# Altium schematic sheet alimentation.SchDoc
size A4; SheetNumber: 1; SheetTotal: 2
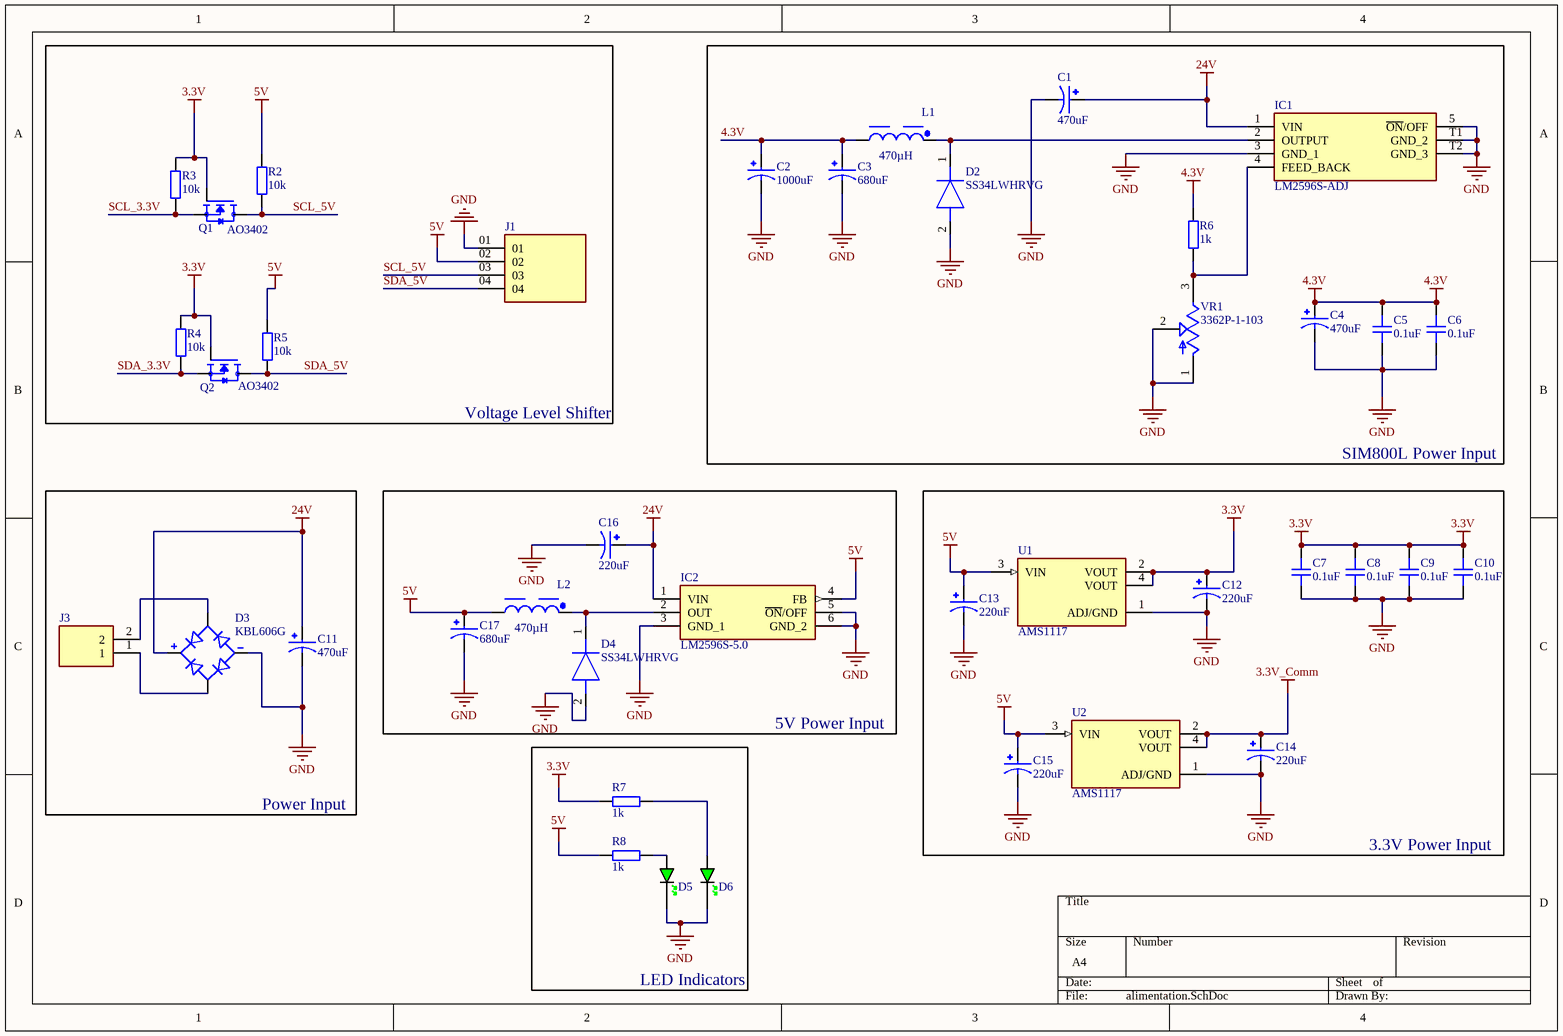
[diagram p0: alimentation.SchDoc]

## Parts
C1  470uF  [CAPPRD500W60D1000H1600]
C2  1000uF  [CAPPRD500W60D1000H2500]
C3  680uF  [CAPPRD500W60D1000H1600]
C4  470uF  [CAPPRD500W60D1000H1600]
C5  0.1uF  [CAP_0805]
C6  0.1uF  [CAP_0805]
C7  0.1uF  [CAP_0805]
C8  0.1uF  [CAP_0805]
C9  0.1uF  [CAP_0805]
C10  0.1uF  [CAP_0805]
C11  470uF  [CAPPRD500W60D1000H1600]
C12  220uF  [CAPPRD500W60D800H1150]
C13  220uF  [CAPPRD500W60D800H1150]
C14  220uF  [CAPPRD500W60D800H1150]
C15  220uF  [CAPPRD500W60D800H1150]
C16  220uF  [CAPPRD500W60D800H1150]
C17  680uF  [CAPPRD500W60D1000H1600]
D2  SS34LWHRVG  [SODFL3718X102N]
D3  KBL606G  [SIP600W130P510L1900H1630Q4]
D4  SS34LWHRVG  [SODFL3718X102N]
D5  GREEN  [LED_0805_GREEN]  (value not drawn)
D6  GREEN  [LED_0805_GREEN]  (value not drawn)
IC1  LM2596S-ADJ  [LM2596SXADJ]
IC2  LM2596S-5.0  [KTT0005B]
J1  MTSW-104-08-S-S-270  [SAMTEC_MTSW-104-08-S-S-270]  (value not drawn)
J3  TBP04R12-500-02BE  [CUI_TBP04R12-500-02BE]  (value not drawn)
L1  470µH  [WE-PD HV_1210]
L2  470µH  [WE-PD HV_1210]
Q1  AO3402  [SOT95P280X125-3N]
Q2  AO3402  [SOT95P280X125-3N]
R2  10k  [RES_1206]
R3  10k  [RES_1206]
R4  10k  [RES_1206]
R5  10k  [RES_1206]
R6  1k  [RES_1206]
R7  1k  [RES_1206]
R8  1k  [RES_1206]
U1  AMS1117  [SOT229P700X180-4N]
U2  AMS1117  [SOT229P700X180-4N]
VR1  3362P-1-103  [TRIM_3362P-1-103]

## Blocks framed on the sheet
Voltage Level Shifter: J1 Q1 Q2 R2-R5
SIM800L Power Input: C1-C6 D2 IC1 L1 R6 VR1
Power Input: C11 D3 J3
5V Power Input: C16 C17 D4 IC2 L2
3.3V Power Input: C7-C10 C12-C15 U1 U2
LED Indicators: D5 D6 R7 R8

## Nets
3.3V: C7.2 C8.2 C9.2 C10.2 C12.P Q1.1(G) Q2.1(G) R3.1 R4.1 R7.1 U1.2(VOUT) U1.4(VOUT)
3.3V_Comm: C14.P U2.2(VOUT) U2.4(VOUT)
4.3V: C2.P C3.P C4.P C5.2 C6.2 L1.2 R6.2
5V: C13.P C15.P C17.P IC2.4(FB) J1.02 L2.2 R2.1 R5.1 R8.1 U1.3(VIN) U2.3(VIN)
24V: C1.P C11.P C16.P D3.POS IC1.1(VIN) IC2.1(VIN)
GND: C1.N C2.N C3.N C4.N C5.1 C6.1 C7.1 C8.1 C9.1 C10.1 C11.N C12.N C13.N C14.N C15.N C16.N C17.N D2.2(A) D3.NEG D4.2(A) D5.K D6.K IC1.3(GND_1) IC1.5(~{ON}/OFF) IC1.T1(GND_2) IC1.T2(GND_3) IC2.3(GND_1) IC2.5(~{ON}/OFF) IC2.6(GND_2) J1.01 U1.1(ADJ/GND) U2.1(ADJ/GND) VR1.1(CCW) VR1.2(WIPER)
SCL_3.3V: Q1.2(S) R3.2
SCL_5V: J1.03 Q1.3(D) R2.2
SDA_3.3V: Q2.2(S) R4.2
SDA_5V: J1.04 Q2.3(D) R5.2
NetD2_1: D2.1(K) IC1.2(OUTPUT) L1.1
NetD3_AC1: D3.AC1 J3.2
NetD3_AC2: D3.AC2 J3.1
NetD4_1: D4.1(K) IC2.2(OUT) L2.1
NetD5_A: D5.A R8.2
NetD6_A: D6.A R7.2
NetIC1_4: IC1.4(FEED_BACK) R6.1 VR1.3(CW)

## Library data of the parts
C1 C3 C4 C11 C17 = EEUHD1V681B: CAP ALUM 680UF 20% 35V RADIAL; MF: Panasonic; MP: EEU-HD1V681B; Package: RADIAL-2 Panasonic; Price: None; Check_prices: https://www.snapeda.com/parts/EEU-HD1V681B/Panasonic/view-part/?ref=eda; Value: *; SnapEDA_Link: https://www.snapeda.com/parts/EEU-HD1V681B/Panasonic/view-part/?ref=snap; Availability: In Stock; Purchase-URL: https://pricing.snapeda.com/search?q=EEU-HD1V681B&ref=eda
C2 = EEUFS1V102L: 1000ÂµF 35V Aluminum Electrolytic Capacitors Radial, Can 10000 Hrs @ 105Â°C; MF: Panasonic; Package: RADIAL-2 Panasonic; SnapEDA_Link: https://www.snapeda.com/parts/EEUFS1V102L/Panasonic/view-part/?ref=snap; Value: *; MP: EEUFS1V102L; Check_prices: https://www.snapeda.com/parts/EEUFS1V102L/Panasonic/view-part/?ref=eda; Availability: In Stock; Purchase-URL: https://pricing.snapeda.com/search/part/EEUFS1V102L/?ref=eda; Price: None
C5-C10 = CAP_0805: Capacitor SMD 0805; Manufacturer: *; Manufacturer Part Number: *; Distributor Link: *; LCSC: *; Rating: *; Dielectric: *
C12-C16 = EEUHD1V221B: Cap Aluminum 220uF 35V 20% (8 X 11.5mm) Radial 5mm 270mA 1000 hr 105C Ammo Pack; MP: EEU-HD1V221B; MF: Panasonic; Package: RADIAL-2 Panasonic; Availability: In Stock; Value: *; SnapEDA_Link: https://www.snapeda.com/parts/EEU-HD1V221B/Panasonic/view-part/?ref=snap; Price: None; Check_prices: https://www.snapeda.com/parts/EEU-HD1V221B/Panasonic/view-part/?ref=eda; Purchase-URL: https://pricing.snapeda.com/search/part/EEU-HD1V221B/?ref=eda
D2 D4 = SS34LWHRVG: Diode; Manufacturer_Name: Taiwan Semiconductor; Datasheet Link: https://datasheet.datasheetarchive.com/originals/distributors/DKDS-20/389381.pdf; Height: 1.02mm; Manufacturer_Part_Number: SS34LWHRVG; Mouser Part Number: 821-SS34LWHRVG; Mouser Price/Stock: https://www.mouser.co.uk/ProductDetail/Taiwan-Semiconductor/SS34LWHRVG?qs=5aG0NVq1C4zYvYQjFNyRbA%3D%3D; Arrow Part Number: SS34LWHRVG; Arrow Price/Stock: https://www.arrow.com/en/products/ss34lwhrvg/taiwan-semiconductor?region=asia
D5 D6 = LED_0805_GREEN: LED 0805 GREEN SMD; Manufacturer: *; Manufacturer Part Number: *; Distributor Link: *; LCSC: *
IC1 = LM2596S-ADJ: Integrated Circuit; Manufacturer_Name: Texas Instruments; Datasheet Link: https://www.ti.com/lit/ds/symlink/lm2596.pdf?HQS=ti-null-null-sf-df-pf-sep-wwe&ts=1592978195629; Height: 4.57mm; Manufacturer_Part_Number: LM2596S-ADJ; Mouser Part Number: 926-LM2596S-ADJ; Mouser Price/Stock: https://www.mouser.co.uk/ProductDetail/Texas-Instruments/LM2596S-ADJ?qs=X1J7HmVL2ZGmRmhAtwKZ2Q%3D%3D
IC2 = LM2596S-5.0: Integrated Circuit; Manufacturer_Name: Texas Instruments; Datasheet Link: https://www.ti.com/lit/gpn/LM2596; Manufacturer_Part_Number: LM2596S-5.0; Mouser Part Number: 926-LM2596S-50; Mouser Price/Stock: https://www.mouser.co.uk/ProductDetail/Texas-Instruments/LM2596S-5.0?qs=X1J7HmVL2ZGcOr96VNr%252B%2Fw%3D%3D; Arrow Part Number: LM2596S-5.0; Arrow Price/Stock: https://www.arrow.com/en/products/lm2596s-5.0/texas-instruments?region=nac
J1 = MTSW-104-08-S-S-270: Connector Header Through Hole 4 position 0.100 (2.54mm); MF: Samtec; SnapEDA_Link: https://www.snapeda.com/parts/MTSW-104-08-S-S-270/Samtec/view-part/?ref=snap; Package: None; Value: *; MP: MTSW-104-08-S-S-270; Check_prices: https://www.snapeda.com/parts/MTSW-104-08-S-S-270/Samtec/view-part/?ref=eda
J3 = TBP04R12-500-02BE: 2~24 Poles, Pluggable, Receptacle, Horizontal, 5.0 Pitch, Terminal Block Connector; MF: Same Sky; SnapEDA_Link: https://www.snapeda.com/parts/TBP04R12-500-02BE/Same+Sky/view-part/?ref=snap; Package: None; Value: *; MP: TBP04R12-500-02BE; Check_prices: https://www.snapeda.com/parts/TBP04R12-500-02BE/Same+Sky/view-part/?ref=eda
L1 L2 = 7687709102: WE-PD HV High Voltage Power Inductor, SMT, size 1210, 1000µH, 0.72A, 1.4Ω; Manufacturer: Wurth Elektronik; Case/Size Code: 1210; DC Resistance: 1.2Ω; Operating Voltage (DC): 400V; Saturation Current: 0.9A; Self Resonant Frequency: 1.2MHz; Manufacturer Part Number: 7687709102; Category: Power Inductors; Match Code: WE-PD HV; ComponentLink1Description: Website Link; ComponentLink1URL: https://www.we-online.com/redexpert/article/7687709102?ad; ComponentLink2Description: Datasheet Link; ComponentLink2URL: https://www.we-online.com/redexpert/spec/7687709102?ad; Mount: Surface Mount; Min Operating Temperature: -40°C; Max Operating Temperature: 125°C; Packaging: Tape and Reel; Length: 12mm; Width: 12mm; Height: 10.5mm; DC Resistance Max: 1.4Ω; Inductance: 1000µH; Rated Current: 0.72A
Q1 Q2 = AO3402: N-Channel 30 V 4A (Ta) 1.4W (Ta) Surface Mount SOT-23-3; MF: Alpha & Omega Semiconductor; SnapEDA_Link: https://www.snapeda.com/parts/AO3402/Alpha/view-part/?ref=snap; Package: SOT-23 Alpha &amp; Omega Semiconductor; Value: *; MP: AO3402; Check_prices: https://www.snapeda.com/parts/AO3402/Alpha/view-part/?ref=eda
R2-R8 = RES_1206: Resistor SMD 1206; Manufacturer: *; Manufacturer Part Number: *; Distributor Link: *; LCSC: *
U1 U2 = AMS1117: 1A LOW DROPOUT VOLTAGE REGULATOR SOT-223; MF: Advanced Monolithic Systems; SnapEDA_Link: https://www.snapeda.com/parts/AMS1117/Advanced+Monolithic+Systems/view-part/?ref=snap; Package: SOT-223 Seeed Technology; Value: *; MP: AMS1117; Check_prices: https://www.snapeda.com/parts/AMS1117/Advanced+Monolithic+Systems/view-part/?ref=eda
VR1 = 3362P-1-103: TRIMMER - 1/4in SQ ST CERMET | Bourns 3362P-1-103; SnapEDA_Link: https://www.snapeda.com/parts/3362P-1-103/Bourns/view-part/?ref=snap; Package: 3362P-1 Bourns Inc.; Value: *; MF: Bourns; MP: 3362P-1-103; Check_prices: https://www.snapeda.com/parts/3362P-1-103/Bourns/view-part/?ref=eda
D3 = KBL606G: Value: *; MP: KBL606G; Availability: Unavailable; Price: None; Package: None